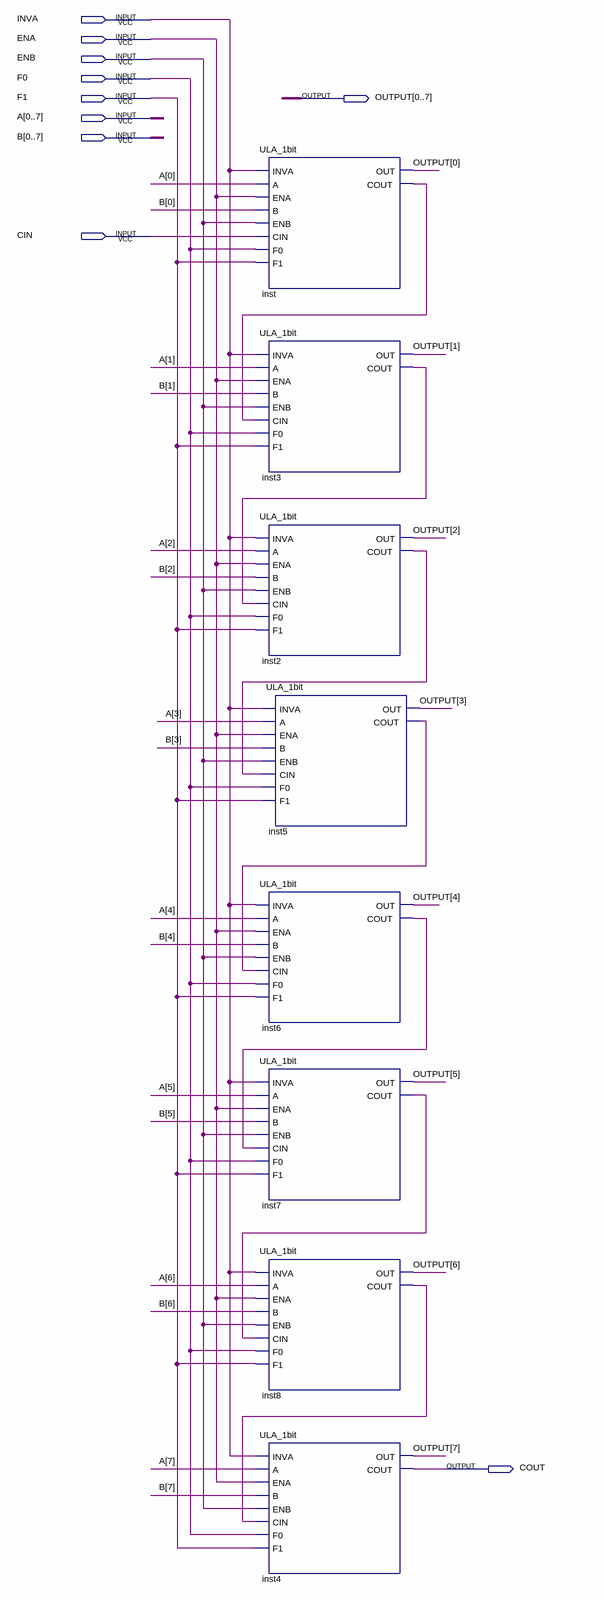
[diagram p0: schematic sheet]
// Quartus schematic ULA_8bit.bdf as structural Verilog: 8 symbols, 10 pins
module ULA_8bit (
  input  INVA,
  input  ENA,
  input  ENB,
  input  F0,
  input  F1,
  input  [0:7] A,
  input  [0:7] B,
  input  CIN,
  output [0:7] OUTPUT,
  output COUT
);

  wire inst2_cout, inst3_cout, inst5_cout, inst6_cout, inst7_cout, inst8_cout, inst_cout;

  ULA_1bit inst (
    .INVA(INVA), .A(A[0]), .ENA(ENA), .B(B[0]), .ENB(ENB), .F0(F0), .F1(F1), .CIN(CIN), .OUT(OUTPUT[0]),
    .COUT(inst_cout));
  ULA_1bit inst3 (
    .INVA(INVA), .A(A[1]), .ENA(ENA), .B(B[1]), .ENB(ENB), .F0(F0), .F1(F1), .CIN(inst_cout),
    .OUT(OUTPUT[1]), .COUT(inst3_cout));
  ULA_1bit inst2 (
    .INVA(INVA), .A(A[2]), .ENA(ENA), .B(B[2]), .ENB(ENB), .F0(F0), .F1(F1), .CIN(inst3_cout),
    .OUT(OUTPUT[2]), .COUT(inst2_cout));
  ULA_1bit inst5 (
    .INVA(INVA), .A(A[3]), .ENA(ENA), .B(B[3]), .ENB(ENB), .F0(F0), .F1(F1), .CIN(inst2_cout),
    .OUT(OUTPUT[3]), .COUT(inst5_cout));
  ULA_1bit inst6 (
    .INVA(INVA), .A(A[4]), .ENA(ENA), .B(B[4]), .ENB(ENB), .F0(F0), .F1(F1), .CIN(inst5_cout),
    .OUT(OUTPUT[4]), .COUT(inst6_cout));
  ULA_1bit inst7 (
    .INVA(INVA), .A(A[5]), .ENA(ENA), .B(B[5]), .ENB(ENB), .F0(F0), .F1(F1), .CIN(inst6_cout),
    .OUT(OUTPUT[5]), .COUT(inst7_cout));
  ULA_1bit inst8 (
    .INVA(INVA), .A(A[6]), .ENA(ENA), .B(B[6]), .ENB(ENB), .F0(F0), .F1(F1), .CIN(inst7_cout),
    .OUT(OUTPUT[6]), .COUT(inst8_cout));
  ULA_1bit inst4 (
    .INVA(INVA), .A(A[7]), .ENA(ENA), .B(B[7]), .ENB(ENB), .F0(F0), .F1(F1), .CIN(inst8_cout),
    .OUT(OUTPUT[7]), .COUT(COUT));
endmodule
